# Altium schematic sheet Voltage_Sensing_Module.SchDoc
size A4; SPICEModelCacheQEFCYNOZ: <root> / <DocumentId>QEFCYNOZ</DocumentId> / </root>
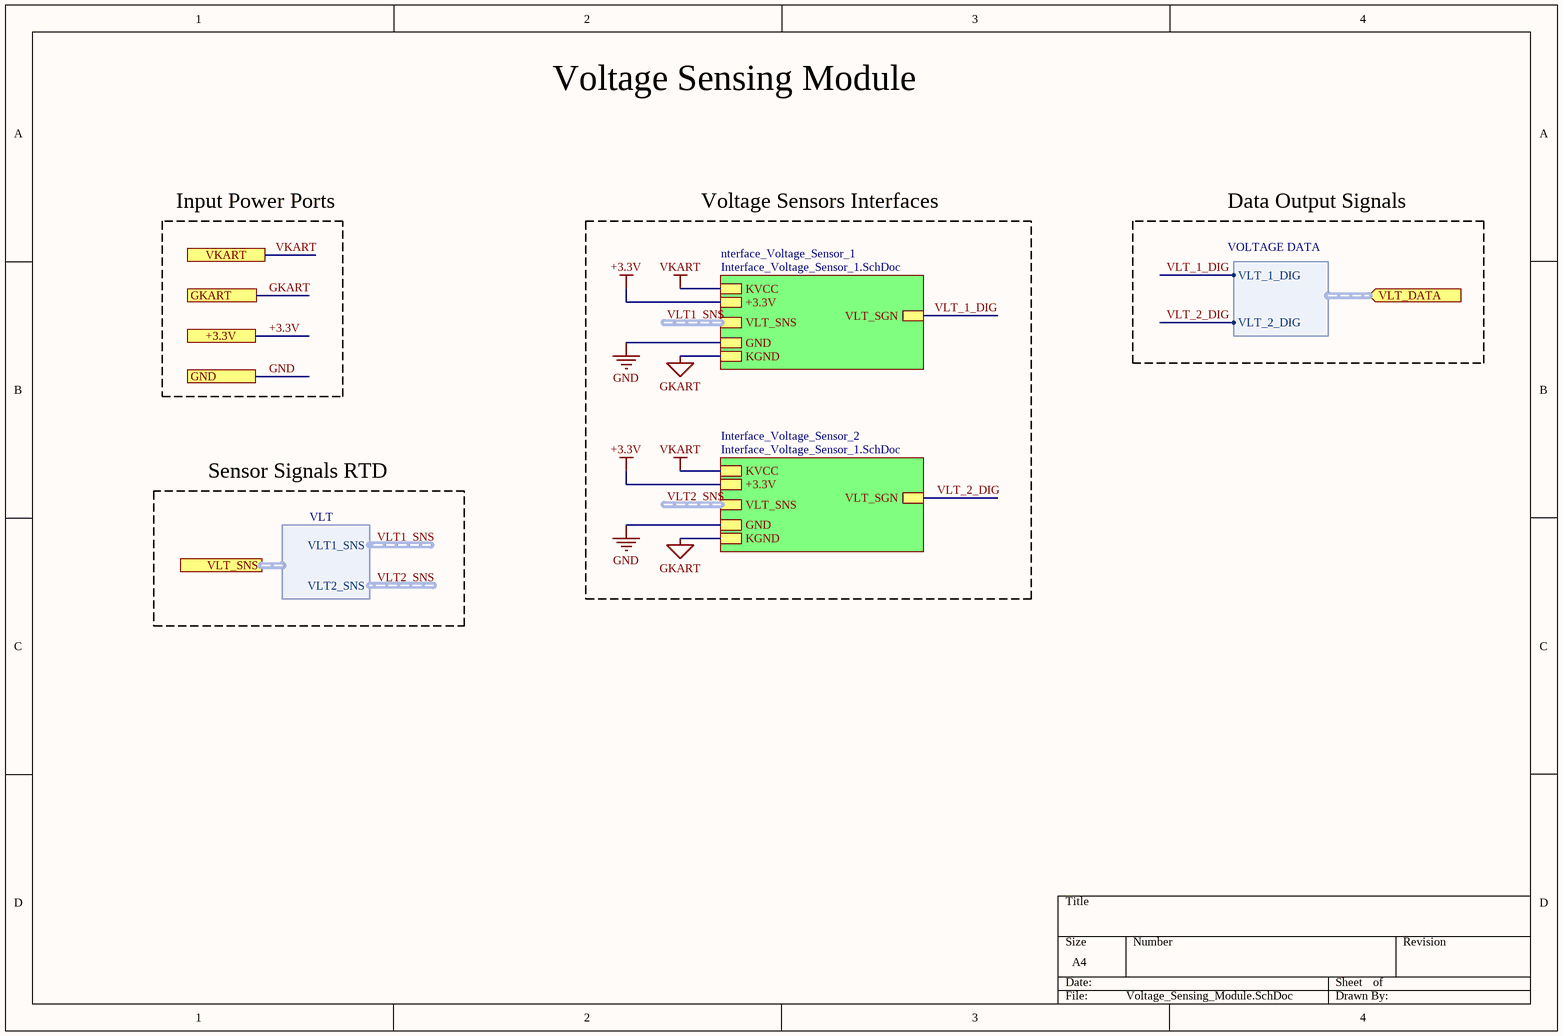
[diagram p0: Voltage_Sensing_Module.SchDoc]

## Sub-sheets
Interface_Voltage_Sensor_2 = Interface_Voltage_Sensor_1.SchDoc: GND, +3.3V, VLT_SGN, KVCC, KGND, VLT_SNS (harness VLT SENSE)
nterface_Voltage_Sensor_1 = Interface_Voltage_Sensor_1.SchDoc: GND, +3.3V, VLT_SGN, KGND, KVCC, VLT_SNS (harness VLT SENSE)

## Ports
+3.3V, GKART, GND, VKART, VLT_DATA (in, harness VOLTAGE DATA), VLT_SNS (harness VLT)

## Harnesses
VOLTAGE DATA: VLT_1_DIG, VLT_2_DIG
VLT: VLT1_SNS, VLT2_SNS

## Nets
+3.3V: port +3.3V, sheet Interface_Voltage_Sensor_2/+3.3V, sheet nterface_Voltage_Sensor_1/+3.3V
GKART: port GKART, sheet Interface_Voltage_Sensor_2/KGND, sheet nterface_Voltage_Sensor_1/KGND
GND: port GND, sheet Interface_Voltage_Sensor_2/GND, sheet nterface_Voltage_Sensor_1/GND
VKART: port VKART, sheet Interface_Voltage_Sensor_2/KVCC, sheet nterface_Voltage_Sensor_1/KVCC
VLT_1_DIG: sheet nterface_Voltage_Sensor_1/VLT_SGN, port VLT_DATA.VLT_1_DIG
VLT_2_DIG: sheet Interface_Voltage_Sensor_2/VLT_SGN, port VLT_DATA.VLT_2_DIG

## Buses and harness runs
harness VLT1_SNS = sheet nterface_Voltage_Sensor_1/VLT_SNS
harness VLT2_SNS = sheet Interface_Voltage_Sensor_2/VLT_SNS

## Notes on the sheet
- Voltage Sensing Module
- Input Power Ports
- Voltage Sensors Interfaces
- Data Output Signals
- Sensor Signals RTD